# Altium schematic sheet stm32LoRaAccel.SchDoc
size A3; CompanyName: HESSO; Address1: Route du Rawyl 47; Address2: 1950 Sion; Address3: Switzerland; DocumentNumber: 1; SheetNumber: 1; SheetTotal: 1; PageSetup: Record=PageOptions|CenterHorizontal=True|CenterVertical=True|PrintScale=1.00|XCorrection=1.00|YCorrection=1.00|PrintKind=1|BorderSize=5000000|LeftOffset=0|BottomOffset=0|Orientation=2|PaperLength=1000|PaperWidth=1000|Scale=100|PaperSource=15|PrintQuality=1200|MediaType=1|DitherType=10|PrintScaleMode=1|PaperKind=A4|PaperIndex=9; ProjectName: Project Name
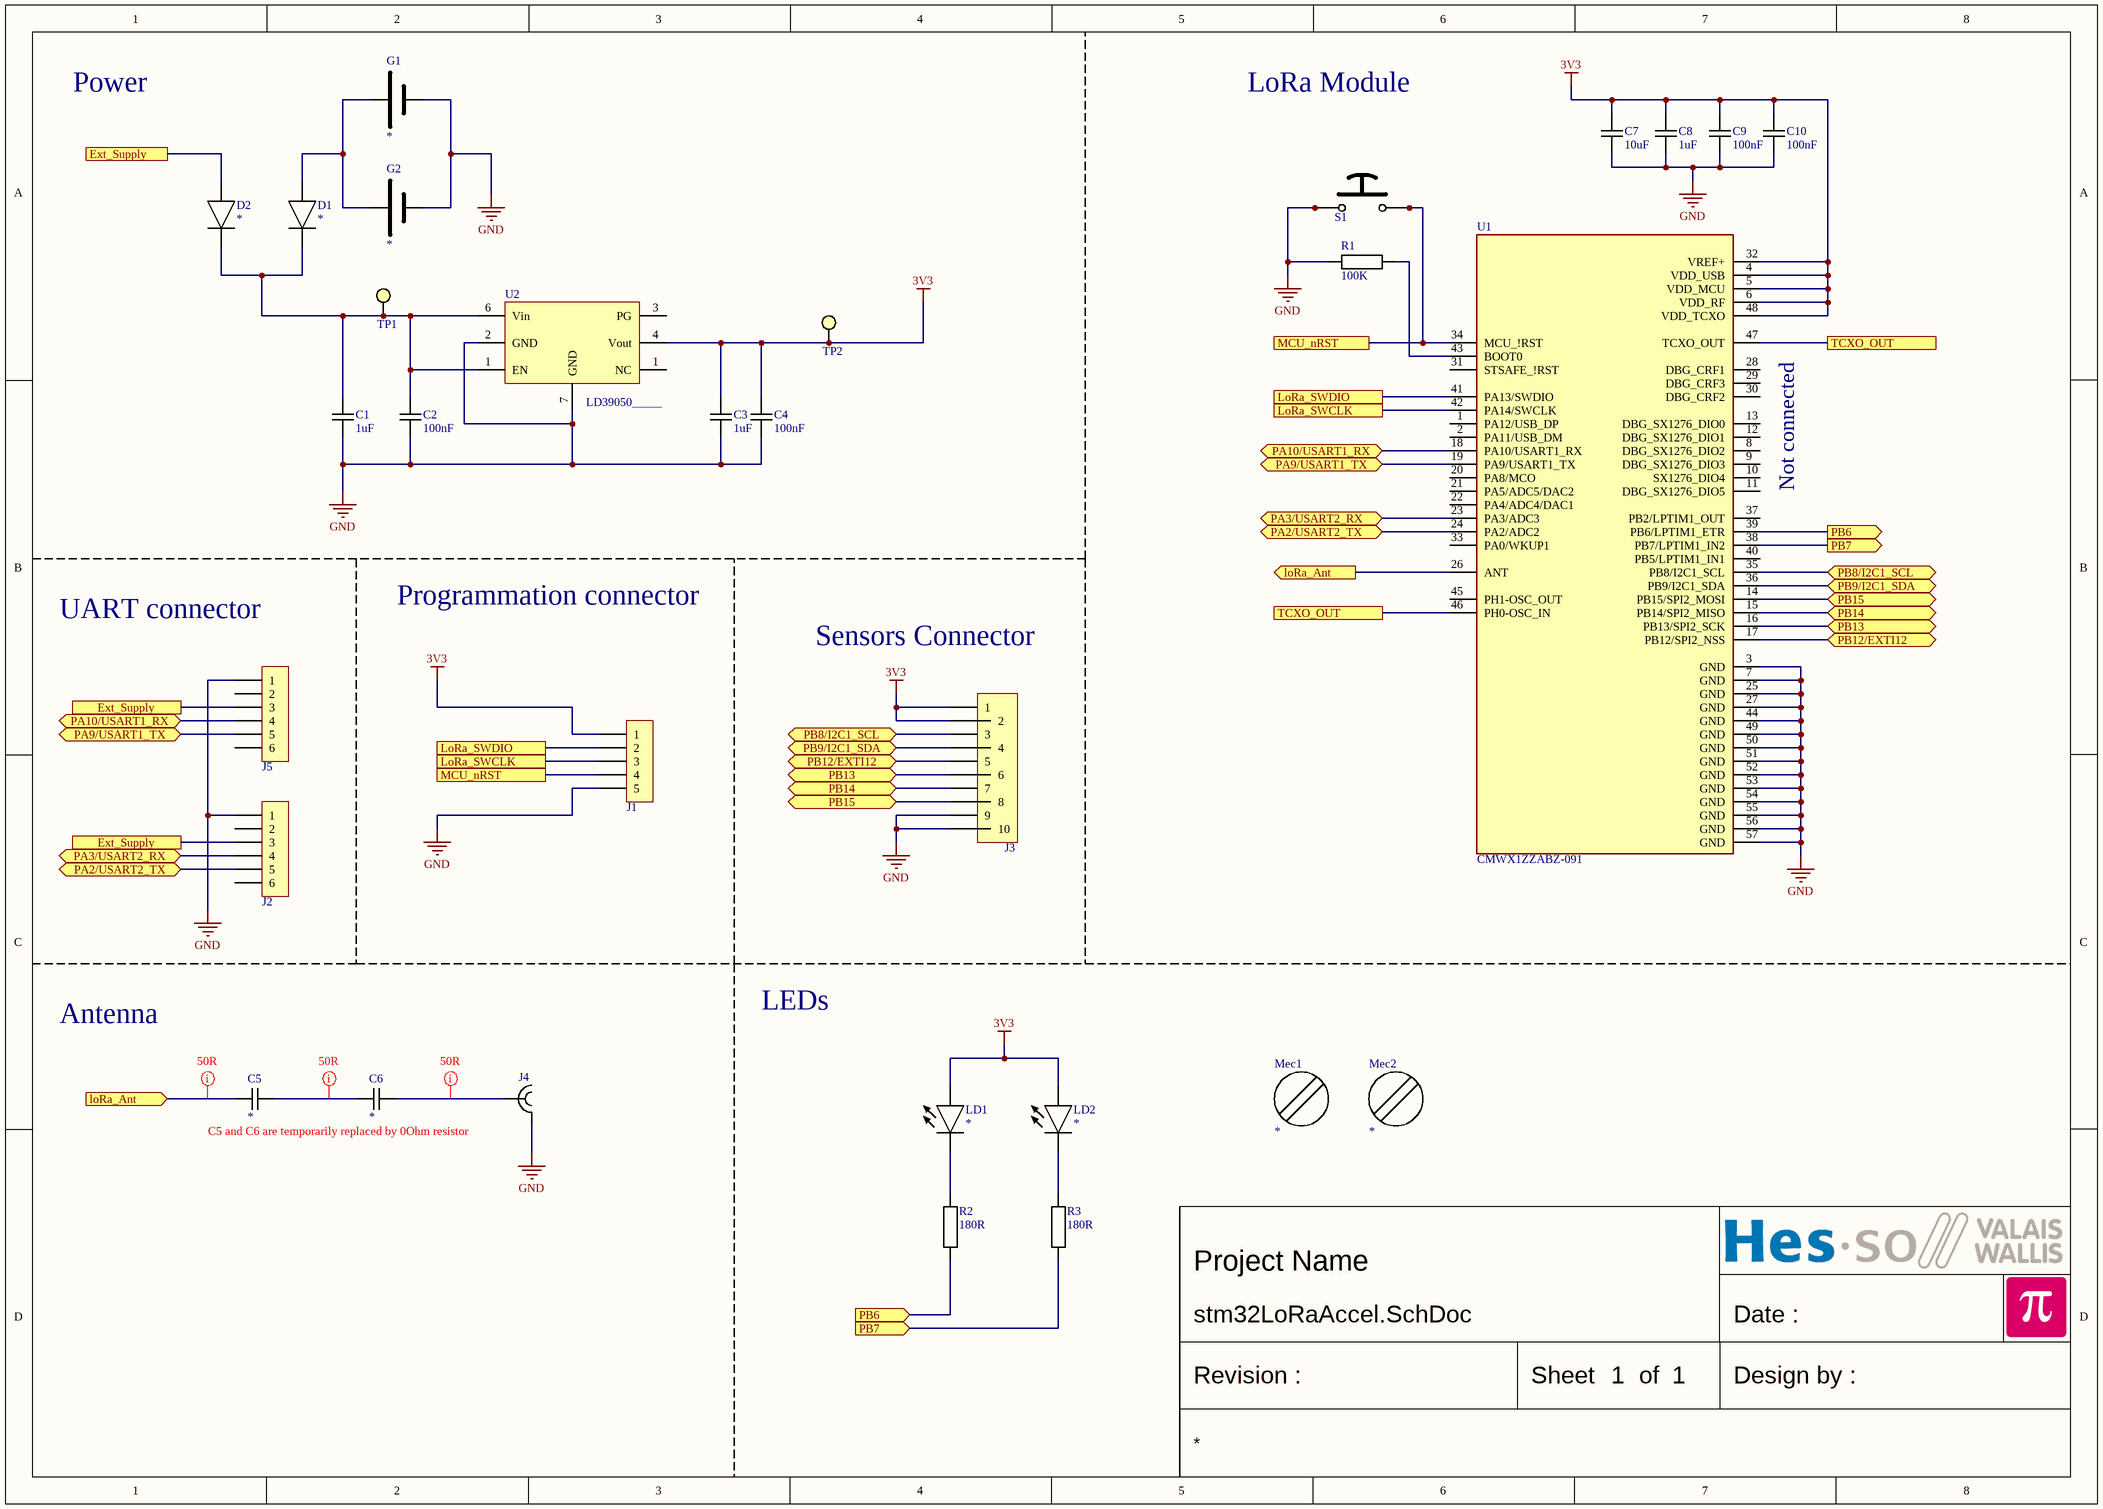
[diagram p0: stm32LoRaAccel.SchDoc]

## Parts
C1  1uF  [CAPACITOR 1608 REFLOW]
C2  100nF  [CAPACITOR 1608 REFLOW]
C3  1uF  [CAPACITOR 1608 REFLOW]
C4  100nF  [CAPACITOR 1608 REFLOW]
C5  *  [CAPACITOR 1608 REFLOW]
C6  *  [CAPACITOR 1608 REFLOW]
C7  10uF  [CAPACITOR 1608 REFLOW]
C8  1uF  [CAPACITOR 1608 REFLOW]
C9  100nF  [CAPACITOR 1608 REFLOW]
C10  100nF  [CAPACITOR 1608 REFLOW]
D1  *  [DIODE DO-214AC (SMA)]
D2  *  [DIODE DO-214AC (SMA)]
G1  *  [Battery Holder Keystone 18650 TH 1131]
G2  *  [Battery Holder Keystone 18650 TH 1131]
J1  *  [PinHeader1x5 P2.54]  (value not drawn)
J2  *  [PinHeader1x6 P2.54]  (value not drawn)
J3  *  [PinHeader2x5 P1.27 SMD H5.9]  (value not drawn)
J4  CONSMA001-G  [SMA EDGE SAMTEC SMA-J-P-H-ST-EM1]  (value not drawn)
J5  *  [PinHeader1x6 P2.54]  (value not drawn)
LD1  *  [LED 1608 REFLOW]
LD2  *  [LED 1608 REFLOW]
Mec1  *  [Screw M3X5 Unconnected]
Mec2  *  [Screw M3X5 Unconnected]
R1  100K  [RESISTOR 1608 REFLOW]
R2  180R  [RESISTOR 1608 REFLOW]
R3  180R  [RESISTOR 1608 REFLOW]
S1  *  [Push Button C6.0x6.0 TE FSM-2J-SMA]  (value not drawn)
TP1  *  [Test Point Keystone Compact BLUE]  (value not drawn)
TP2  *  [Test Point Keystone Compact BLUE]  (value not drawn)
U1  CMWX1ZZABZ-091  [CMWX1ZZABZ-091]
U2  LD39050_____  [DFN6 P0.95 T1.75X2.50 C3.0X3.0 H1.0]

## Ports
Ext_Supply, loRa_Ant (in), loRa_Ant (out), LoRa_SWCLK, LoRa_SWDIO, MCU_nRST, PA2/USART2_TX (bidir), PA3/USART2_RX (bidir), PA9/USART1_TX (bidir), PA10/USART1_RX (bidir), PB6 (in), PB6 (out), PB7 (in), PB7 (out), PB8/I2C1_SCL (bidir), PB9/I2C1_SDA (bidir), PB12/EXTI12 (bidir), PB13 (bidir), PB14 (bidir), PB15 (bidir), TCXO_OUT

## Nets
3V3: C3.1 C4.1 C7.1 C8.1 C9.1 C10.1 J1.1 J3.1 J3.2 LD1.2(A) LD2.2(A) TP2.1 U1.4(VDD_USB) U1.5(VDD_MCU) U1.6(VDD_RF) U1.32(VREF+) U1.48(VDD_TCXO) U2.4(Vout)
GND: C1.2 C2.2 C3.2 C4.2 C7.2 C8.2 C9.2 C10.2 G1.2(—) G2.2(—) J1.5 J2.1 J3.9 J3.10 J4.2 J5.1 R1.2 S1.1 S1.2 U1.3(GND) U1.7(GND) U1.25(GND) U1.27(GND) U1.44(GND) U1.49(GND) U1.50(GND) U1.51(GND) U1.52(GND) U1.53(GND) U1.54(GND) U1.55(GND) U1.56(GND) U1.57(GND) U2.2(GND) U2.7(GND)
Ext_Supply: D2.2(A) J2.3 J5.3 ; port Ext_Supply
loRa_Ant: C5.2 U1.26(ANT) ; port loRa_Ant
LoRa_SWCLK: J1.3 U1.42(PA14/SWCLK) ; port LoRa_SWCLK
LoRa_SWDIO: J1.2 U1.41(PA13/SWDIO) ; port LoRa_SWDIO
MCU_nRST: J1.4 S1.3 S1.4 U1.34(MCU_!RST) ; port MCU_nRST
PA2/USART2_TX: J2.5 U1.24(PA2/ADC2) ; port PA2/USART2_TX
PA3/USART2_RX: J2.4 U1.23(PA3/ADC3) ; port PA3/USART2_RX
PA9/USART1_TX: J5.5 U1.19(PA9/USART1_TX) ; port PA9/USART1_TX
PA10/USART1_RX: J5.4 U1.18(PA10/USART1_RX) ; port PA10/USART1_RX
PB6: R2.2 U1.39(PB6/LPTIM1_ETR) ; port PB6
PB7: R3.2 U1.38(PB7/LPTIM1_IN2) ; port PB7
PB8/I2C1_SCL: J3.3 U1.35(PB8/I2C1_SCL) ; port PB8/I2C1_SCL
PB9/I2C1_SDA: J3.4 U1.36(PB9/I2C1_SDA) ; port PB9/I2C1_SDA
PB12/EXTI12: J3.5 U1.17(PB12/SPI2_NSS) ; port PB12/EXTI12
PB13: J3.6 U1.16(PB13/SPI2_SCK) ; port PB13
PB14: J3.7 U1.15(PB14/SPI2_MISO) ; port PB14
PB15: J3.8 U1.14(PB15/SPI2_MOSI) ; port PB15
TCXO_OUT: U1.46(PH0-OSC_IN) U1.47(TCXO_OUT) ; port TCXO_OUT
NetC1_1: C1.1 C2.1 D1.1(C) D2.1(C) TP1.1 U2.1(NC) U2.6(Vin)
NetC5_1: C5.1 C6.2
NetC6_1: C6.1 J4.1
NetD1_2: D1.2(A) G1.1(+) G2.1(+)
NetLD1_1: LD1.1(C) R2.1
NetLD2_1: LD2.1(C) R3.1
NetR1_1: R1.1 U1.43(BOOT0)

Not connected (* = marked no-connect by the designer): J2 2 6; J5 2 6; U1 1(PA12/USB_DP) 2(PA11/USB_DM) 8(DBG_SX1276_DIO2) 9(DBG_SX1276_DIO3) 10(SX1276_DIO4) 11(DBG_SX1276_DIO5) 12(DBG_SX1276_DIO1) 13(DBG_SX1276_DIO0) 20(PA8/MCO) 21(PA5/ADC5/DAC2) 22(PA4/ADC4/DAC1) 28(DBG_CRF1) 29(DBG_CRF3) 30(DBG_CRF2) 31(STSAFE_!RST) 33(PA0/WKUP1) 37(PB2/LPTIM1_OUT) 40(PB5/LPTIM1_IN1) 45(PH1-OSC_OUT); U2 3(PG)

## Layout directives
mark named 50R: loRa_Ant, NetC5_1, NetC6_1

## Notes on the sheet
- Power
- LoRa Module
- (near U1) Not connected
- UART connector
- Programmation connector
- Sensors Connector
- Antenna
- LEDs
- C5 and C6 are temporarily replaced by 0Ohm resistor
- Date :
- Revision :
- Sheet
- of
- Design by :

## Library data of the parts
C1-C10 = Capacitor
  C1 C3 C8: Value: 1uF
  C2 C4 C9 C10: Value: 100nF
  C5 C6: Value: *
  C7: Value: 10uF
D1 D2 = DIODE: Diode generic 2 leads; Value: *
G1 G2 = Battery: Battery Generic; Value: *
J1 = PinHeader1x5: Plug connector; Value: *
J2 J5 = PinHeader1x6: Plug connector; Value: *
J3 = PinHeader2x5: Plug connector; Value: *
J4 = SMA EDGE SAMTEC SMA-J-P-H-ST-EM1: Value: CONSMA001-G
LD1 LD2 = LED: LED generic; Value: *
Mec1 Mec2 = Screw Unconnected: Screw Unconnected BN330; Value: *
R1-R3 = Resistor
  R1: Value: 100K
  R2 R3: Value: 180R
S1 = Push Button 4Pins: Push Button, 4 pins, 2 poles parrallèle; Value: *
TP1 TP2 = Test Point: Value: *
U1 = CMWX1ZZABZ-091: General ISM < 1GHz LoRaWan Transceiver Module 868MHz, 915MHz Surface Mount; MF: Murata Electronics; SnapEDA_Link: https://www.snapeda.com/parts/CMWX1ZZABZ-091/Murata%20Electronics%20North%20America/view-part/1356960/?ref=snap; Availability: Unavailable; MP: CMWX1ZZABZ-091; Price: None; Value: CMWX1ZZABZ-091; Package: Module Murata Electronics
U2 = LD39050_____: 500 mA low quiescent current and low noise voltage regulator; Manufacturer: ST; Value: LD39050_____; Mouser No: *